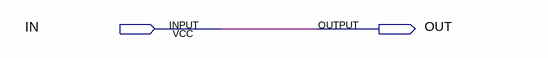
[diagram p0: schematic sheet]
// Quartus schematic BUF.bdf as structural Verilog: 0 symbols, 2 pins
module BUF (
  input  IN,
  output OUT
);


  assign OUT = IN;
endmodule
